# EAGLE schematic FuseBox.ECU_R3 (EAGLE 6.5.0)
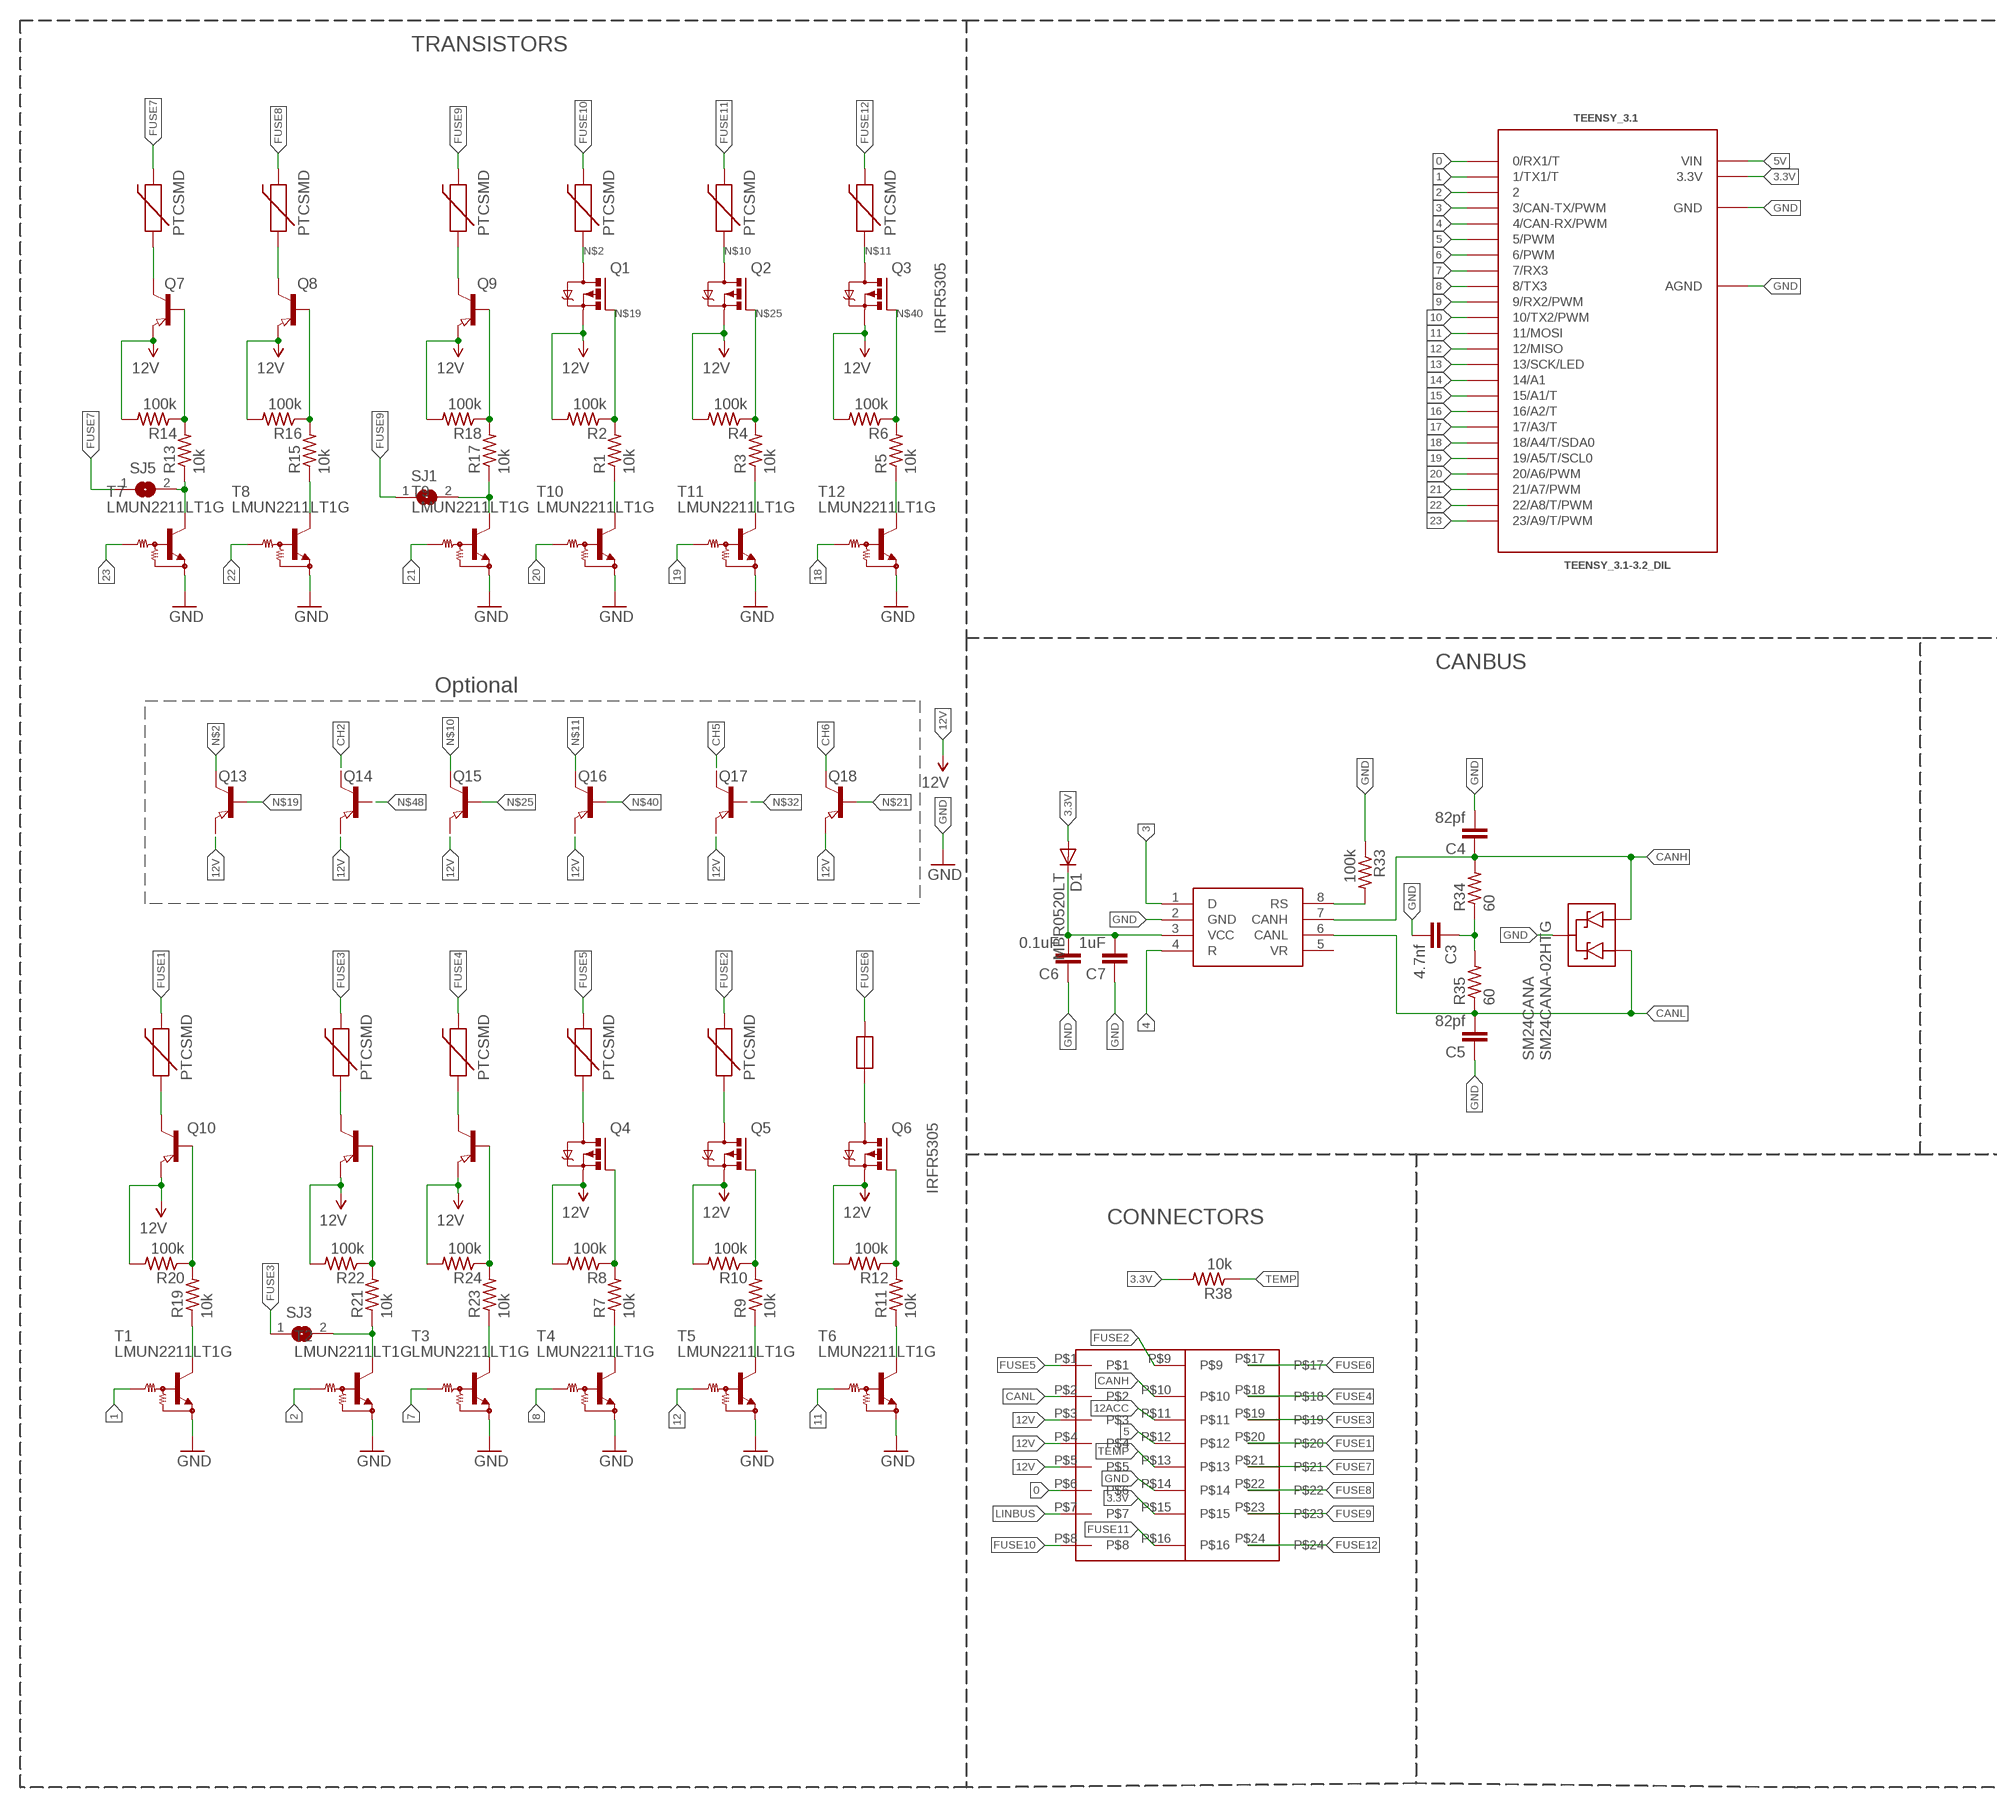
[diagram p0: schematic, sheet 1, part 1 of 2]
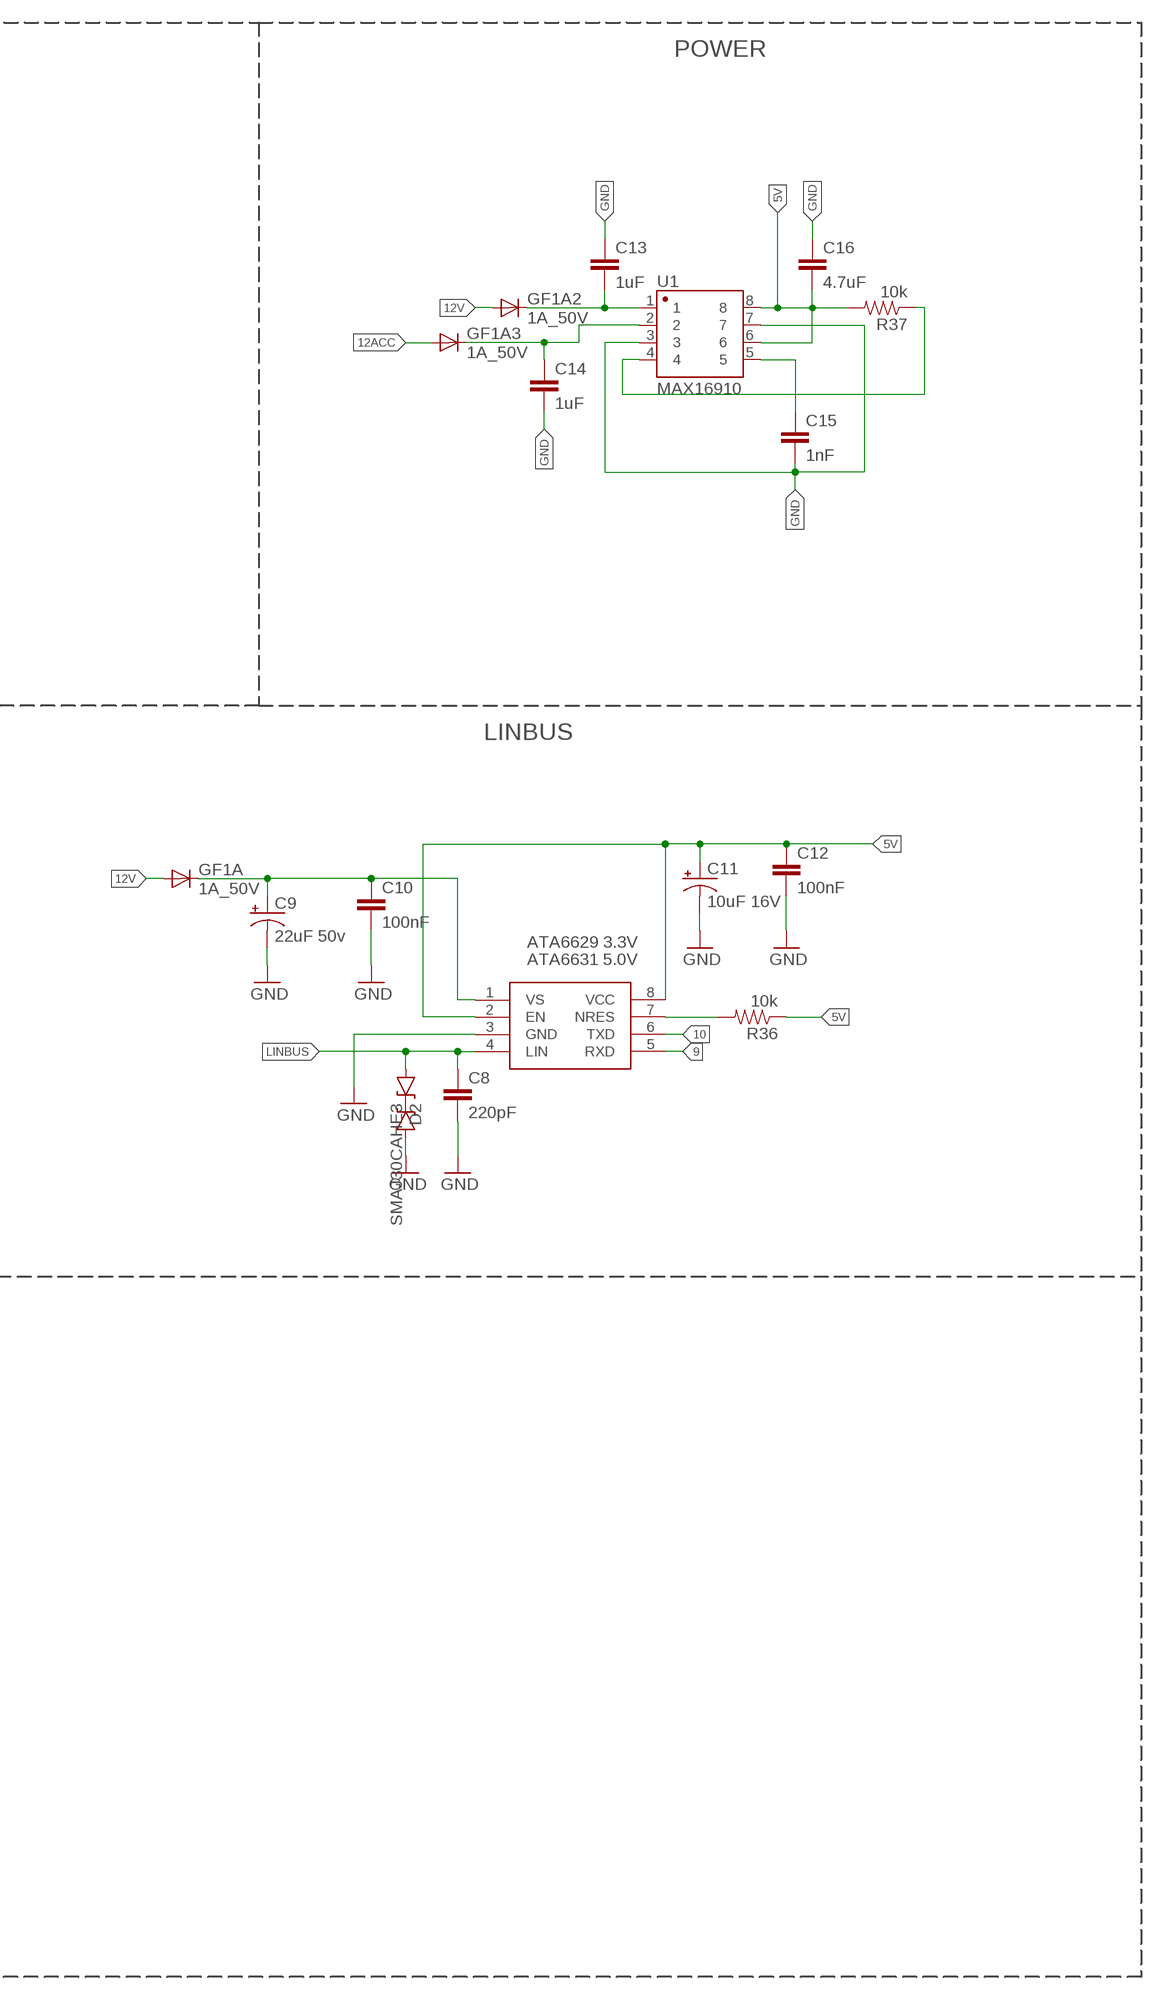
[diagram p1: schematic, sheet 1, part 2 of 2]

## Parts
ATA6631  ATA6631  [S08]
C3  4.7nf  CAP0603-CAP  [0603-CAP]
C4  82pf  CAP0603-CAP  [0603-CAP]
C5  82pf  CAP0603-CAP  [0603-CAP]
C6  0.1uF  CAP0603-CAP  [0603-CAP]
C7  1uF  CAP0603-CAP  [0603-CAP]
C8  220pF  CAP0603-CAP  [0603-CAP]
C9  22uF 50v  CAP_POLD  [PANASONIC_D]
C10  100nF  CAP0603-CAP  [0603-CAP]
C11  10uF 16V  CAP_POL1206  [EIA3216]
C12  100nF  CAP0603-CAP  [0603-CAP]
C13  1uF  CAP0805  [0805]
C14  1uF  CAP0805  [0805]
C15  1nF  CAP0805  [0805]
C16  4.7uF  CAP0805  [0805]
D1  MBR0520LT  [SOD123]
D2  SMAJ30CAHE3  [SMA-DIODE]
F1  PTCSMD  [PTC-1206]
F2  PTCSMD  [PTC-1206]
F3  PTCSMD  [PTC-1206]
F4  PTCSMD  [PTC-1206]
F5  PTCSMD  [PTC-1206]
F6  PTCSMD  [PTC-1206]
F7  PTCSMD  [PTC-1206]
F8  PTCSMD  [PTC-1206]
F9  PTCSMD  [PTC-1206]
F10  PTCSMD  [PTC-1206]
F11  PTCSMD  [PTC-1206]
GF1A  1A_50V  DIODE-DO-214AC  [DO-214AC]
GF1A2  1A_50V  DIODE-DO-214AC  [DO-214AC]
GF1A3  1A_50V  DIODE-DO-214AC  [DO-214AC]
Q1  IRFR5305  [D-PAK_TO252AA]
Q2  IRFR5305  [D-PAK_TO252AA]
Q3  IRFR5305  [D-PAK_TO252AA]
Q4  IRFR5305  [D-PAK_TO252AA]
Q5  IRFR5305  [D-PAK_TO252AA]
Q6  IRFR5305  [D-PAK_TO252AA]
Q7  PNP-TRANSISTOR_SOT23  [SOT23]
Q8  PNP-TRANSISTOR_SOT23  [SOT23]
Q9  PNP-TRANSISTOR_SOT23  [SOT23]
Q10  PNP-TRANSISTOR_SOT23  [SOT23]
Q11  PNP-TRANSISTOR_SOT23  [SOT23]
Q12  PNP-TRANSISTOR_SOT23  [SOT23]
Q13  PNP-TRANSISTOR_SOT23  [SOT23]
Q14  PNP-TRANSISTOR_SOT23  [SOT23]
Q15  PNP-TRANSISTOR_SOT23  [SOT23]
Q16  PNP-TRANSISTOR_SOT23  [SOT23]
Q17  PNP-TRANSISTOR_SOT23  [SOT23]
Q18  PNP-TRANSISTOR_SOT23  [SOT23]
R1  10k  R-US_R0402  [R0402]
R2  100k  R-US_R0402  [R0402]
R3  10k  R-US_R0402  [R0402]
R4  100k  R-US_R0402  [R0402]
R5  10k  R-US_R0402  [R0402]
R6  100k  R-US_R0402  [R0402]
R7  10k  R-US_R0402  [R0402]
R8  100k  R-US_R0402  [R0402]
R9  10k  R-US_R0402  [R0402]
R10  100k  R-US_R0402  [R0402]
R11  10k  R-US_R0402  [R0402]
R12  100k  R-US_R0402  [R0402]
R13  10k  R-US_R0402  [R0402]
R14  100k  R-US_R0402  [R0402]
R15  10k  R-US_R0402  [R0402]
R16  100k  R-US_R0402  [R0402]
R17  10k  R-US_R0402  [R0402]
R18  100k  R-US_R0402  [R0402]
R19  10k  R-US_R0402  [R0402]
R20  100k  R-US_R0402  [R0402]
R21  10k  R-US_R0402  [R0402]
R22  100k  R-US_R0402  [R0402]
R23  10k  R-US_R0402  [R0402]
R24  100k  R-US_R0402  [R0402]
R33  100k  R-US_R0402  [R0402]
R34  60  R-US_R0402  [R0402]
R35  60  R-US_R0402  [R0402]
R36  10k  RESISTOR0603-RES  [0603-RES]
R37  10k  RESISTOR0603-RES  [0603-RES]
R38  10k  R-US_R0402  [R0402]
SJ1  SJ  [SJ]
SJ3  SJ  [SJ]
SJ5  SJ  [SJ]
SM24CANA  SM24CANA-02HTG  MMBZ27VCLT1  [SOT23-3]
T1  LMUN2211LT1G  [SOT23]
T2  LMUN2211LT1G  [SOT23]
T3  LMUN2211LT1G  [SOT23]
T4  LMUN2211LT1G  [SOT23]
T5  LMUN2211LT1G  [SOT23]
T6  LMUN2211LT1G  [SOT23]
T7  LMUN2211LT1G  [SOT23]
T8  LMUN2211LT1G  [SOT23]
T9  LMUN2211LT1G  [SOT23]
T10  LMUN2211LT1G  [SOT23]
T11  LMUN2211LT1G  [SOT23]
T12  LMUN2211LT1G  [SOT23]
TEENSY_3.1  TEENSY_3.1-3.2_DIL  [TEENSY_3.0-3.2&LC_DIL]
U1  MAX16910  GENERIC-SOIC8MSGEQ7N-FILTER  [SO08]
U$2  RESETTABLE_1210  [1210]
U$3  HCCPHPE24BKA90F  [HCCPHPE24BKA90F]
VP230  UP230  SN65HVD230  [SO08]

## Nets
0: TEENSY_3.1.0(0/RX1/T) U$3.P$6
1: T1.1(B) TEENSY_3.1.1(1/TX1/T)
2: T2.1(B) TEENSY_3.1.2
3: TEENSY_3.1.3(3/CAN-TX/PWM) VP230.1(D)
3.3V: D1.A R38.2 TEENSY_3.1.3.3V U$3.P$15
4: TEENSY_3.1.4(4/CAN-RX/PWM) VP230.4(R)
5: TEENSY_3.1.5(5/PWM) U$3.P$12
5V: ATA6631.2(EN) ATA6631.8(VCC) C11.A(+) C12.1 C16.2 R36.1 R37.2 TEENSY_3.1.VIN U1.6 U1.8
6: TEENSY_3.1.6(6/PWM)
7: T3.1(B) TEENSY_3.1.7(7/RX3)
8: T4.1(B) TEENSY_3.1.8(8/TX3)
9: ATA6631.5(RXD) TEENSY_3.1.9(9/RX2/PWM)
10: ATA6631.6(TXD) TEENSY_3.1.10(10/TX2/PWM)
11: T6.1(B) TEENSY_3.1.11(11/MOSI)
12: T5.1(B) TEENSY_3.1.12(12/MISO)
12ACC: GF1A3.A U$3.P$11
12V: GF1A2.A GF1A.A Q1.3(S) Q2.3(S) Q3.3(S) Q4.3(S) Q5.3(S) Q6.3(S) Q7.2(E) Q8.2(E) Q9.2(E) Q10.2(E) Q11.2(E) Q12.2(E) Q13.2(E) Q14.2(E) Q15.2(E) Q16.2(E) Q17.2(E) Q18.2(E) R2.2 R4.2 R6.2 R8.2 R10.2 R12.2 R14.2 R16.2 R18.2 R20.2 R22.2 R24.2 U$3.P$3 U$3.P$4 U$3.P$5
13: TEENSY_3.1.13(13/SCK/LED)
14: TEENSY_3.1.14/A0(14/A1)
15: TEENSY_3.1.15/A1(15/A1/T)
16: TEENSY_3.1.16/A2(16/A2/T)
17: TEENSY_3.1.17/A3(17/A3/T)
18: T12.1(B) TEENSY_3.1.18/A4(18/A4/T/SDA0)
19: T11.1(B) TEENSY_3.1.19/A5(19/A5/T/SCL0)
20: T10.1(B) TEENSY_3.1.20/A6(20/A6/PWM)
21: T9.1(B) TEENSY_3.1.21/A7(21/A7/PWM)
22: T8.1(B) TEENSY_3.1.22/A8(22/A8/T/PWM)
23: T7.1(B) TEENSY_3.1.23/A9(23/A9/T/PWM)
CANH: C4.1 R34.2 SM24CANA.2(A2) U$3.P$10 VP230.7(CANH)
CANL: C5.2 R35.1 SM24CANA.1(A1) U$3.P$2 VP230.6(CANL)
CH2: F1.1 Q5.4(D) Q14.3(C)
CH5: F2.1 Q4.4(D) Q17.3(C)
CH6: Q6.4(D) Q18.3(C) U$2.P$1
CH7: F6.1 Q7.3(C)
CH8: F7.1 Q8.3(C)
CH9: F8.1 Q9.3(C)
FUSE1: F5.2 U$3.P$20
FUSE2: F1.2 U$3.P$9
FUSE3: F4.2 SJ3.1 U$3.P$19
FUSE4: F3.2 U$3.P$18
FUSE5: F2.2 U$3.P$1
FUSE6: U$2.P$2 U$3.P$17
FUSE7: F6.2 SJ5.1 U$3.P$21
FUSE8: F7.2 U$3.P$22
FUSE9: F8.2 SJ1.1 U$3.P$23
FUSE10: F9.2 U$3.P$8
FUSE11: F10.2 U$3.P$16
FUSE12: F11.2 U$3.P$24
GND: ATA6631.3(GND) C3.2 C4.2 C5.1 C6.1 C7.1 C8.2 C9.- C10.2 C11.C(-) C12.2 C13.1 C14.2 C15.2 C16.1 D2.A R33.1 SM24CANA.3(C) T1.2(E) T2.2(E) T3.2(E) T4.2(E) T5.2(E) T6.2(E) T7.2(E) T8.2(E) T9.2(E) T10.2(E) T11.2(E) T12.2(E) TEENSY_3.1.AGND TEENSY_3.1.GND U1.3 U1.7 U$3.P$14 VP230.2(GND)
LINBUS: ATA6631.4(LIN) C8.1 D2.C(A1) U$3.P$7
N$1: C6.2 C7.2 D1.C VP230.3(VCC)
N$2: F9.1 Q1.4(D) Q13.3(C)
N$3: R15.1 T8.3(C)
N$4: Q8.1(B) R15.2 R16.1
N$5: R13.1 SJ5.2 T7.3(C)
N$6: Q7.1(B) R13.2 R14.1
N$7: C13.2 GF1A2.C U1.1
N$8: R17.1 SJ1.2 T9.3(C)
N$10: F10.1 Q2.4(D) Q15.3(C)
N$11: F11.1 Q3.4(D) Q16.3(C)
N$12: C14.1 GF1A3.C U1.2
N$16: Q9.1(B) R17.2 R18.1
N$18: R1.1 T10.3(C)
N$19: Q1.1(G) Q13.1(B) R1.2 R2.1
N$20: R11.1 T6.3(C)
N$21: Q6.1(G) Q18.1(B) R11.2 R12.1
N$22: F5.1 Q10.3(C)
N$23: F4.1 Q11.3(C)
N$24: R3.1 T11.3(C)
N$25: Q2.1(G) Q15.1(B) R3.2 R4.1
N$26: F3.1 Q12.3(C)
N$27: R23.1 T3.3(C)
N$28: Q12.1(B) R23.2 R24.1
N$30: R37.1 U1.4
N$31: R7.1 T4.3(C)
N$32: Q4.1(G) Q17.1(B) R7.2 R8.1
N$34: C15.1 U1.5
N$39: R5.1 T12.3(C)
N$40: Q3.1(G) Q16.1(B) R5.2 R6.1
N$43: R21.1 SJ3.2 T2.3(C)
N$44: Q11.1(B) R21.2 R22.1
N$45: R19.1 T1.3(C)
N$46: Q10.1(B) R19.2 R20.1
N$47: R9.1 T5.3(C)
N$48: Q5.1(G) Q14.1(B) R9.2 R10.1
N$52: R33.2 VP230.8(RS)
N$54: ATA6631.1(VS) C9.+ C10.1 GF1A.C
N$55: ATA6631.7(NRES) R36.2
N$56: C3.1 R34.1 R35.2
TEMP: R38.1 U$3.P$13
Unconnected: VP230.5(VR)

## Notes on the sheet
- TRANSISTORS | POWER
- CANBUS | LINBUS
- Optional
- ATA6629 3.3V
- ATA6631 5.0V
- CONNECTORS

## Library data of the parts
ATA6631 = my-library:ATA6631
C3-C8 C10 C12 = SparkFun-Capacitors:CAP: Capacitor Standard 0603 ceramic capacitor, and 0.1" leaded capacitor.
C9 = SparkFun-Capacitors:CAP_POL: Capacitor Polarized These are standard SMD and PTH capacitors. Normally 10uF, 47uF, and 100uF in electrolytic and tantalum varieties. Always verify the external diameter of the through hole cap, it varies with capacity, voltage, and manufacturer. The EIA devices should be standard.
C11 = SparkFun:CAP_POL: Capacitor Polarized These are standard SMD and PTH capacitors. Normally 10uF, 47uF, and 100uF in electrolytic and tantalum varieties. Always verify the external diameter of the through hole cap, it varies with capacity, voltage, and manufacturer. The EIA devices should be standard.
C13-C16 = SparkFun:CAP: Capacitor Standard 0603 ceramic capacitor, and 0.1" leaded capacitor.
D1 = diode:MBR0520LT: SCHOTTKY BARRIER RECTIFIER Source: http://onsemi.com .. MBR0520LT1-D.pdf
D2 = SparkFun-DiscreteSemi:SMAJ30CAHE3
F1-F11 = SparkFun-PowerIC:PTC: Resettable Fuse PTC Resettable Fuse. Spark Fun Electronics SKU : COM-08357; PROD_ID: RES-11150
GF1A GF1A2 GF1A3 = diode:DIODE-: DIODE
Q1-Q6 = transistor-power:IRF?5305: HEXFET Power MOSFET Source: http://www.irf.com/product-info/datasheets/data/irfr5305pbf.pdf
Q7-Q18 = semicon-smd-ipc:PNP-TRANSISTOR_: PNP TRANSISTOR
R1-R24 R33-R35 R38 = resistor:R-US_: RESISTOR, American symbol
R36 R37 = SparkFun:RESISTOR: Resistor Basic schematic elements and footprints for 0603, 1206, and PTH resistors.
SJ1 SJ3 SJ5 = jumper:SJ: SMD solder JUMPER
SM24CANA = SparkFun-DiscreteSemi:MMBZ27VCLT1: 40W Zener-diode transient voltage suppressor (ESD protection)
T1-T12 = transistor:LMUN2211LT1G
TEENSY_3.1 = Teensy_3_and_LC_Series_Boards_v1.4:TEENSY_3.1-3.2_DIL: Teensy 3.1 or 3.2 in a DIL Layout.
U1 = SparkFun-AnalogIC:GENERIC-SOIC8: A placeholder for generic narrow & wide SOIC8 foorptints - used on the DIP adapter board.; PROD_ID: IC-10141
U$2 = Simplex-Fuses:RESETTABLE: resettable fuse
U$3 = FCI_By_element14_Batch_1:HCCPHPE24BKA90F
VP230 = smd-footprints:SN65HVD230

## Net classes
0 default: width 0.203 mm
1 vcc: width 0.254 mm